# Altium schematic sheet Power Distribution.SchDoc
size A
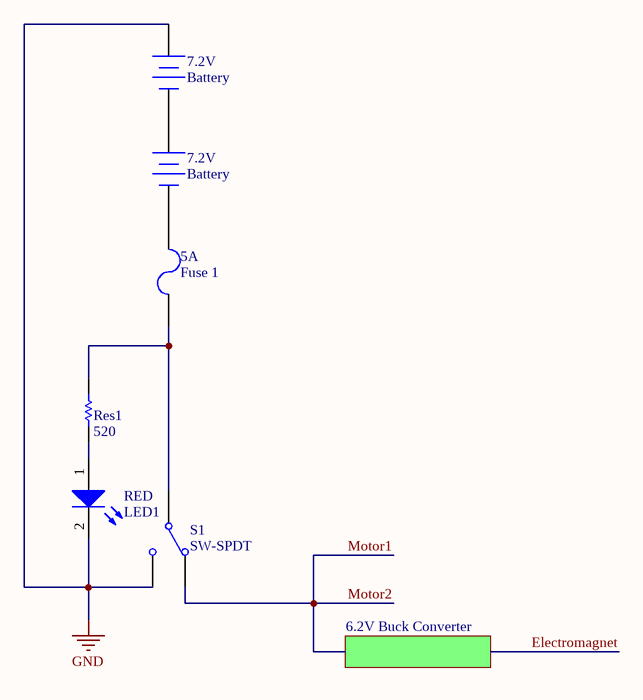
[diagram p0: Power Distribution.SchDoc]

## Parts
(Parts that share a designator on the sheet are numbered #1, #2 ... from top to bottom, then left to right.)
5A  Fuse 1  [PIN-W2/E2.8]
7.2V#1  Battery  [BAT-2]
7.2V#2  Battery  [BAT-2]
R?  Res1  value 520  [AXIAL-0.3]
RED  LED1  [LED-1]
S1  SW-SPDT  [SPDT-3]

## Sub-sheets
Designator = 6.2V Buck Converter: no entries

## Nets
GND: 7.2V#1.1(+) RED.2(K) S1.3(NO)
Motor1: S1.2(NC)  [also labelled Motor2]
Net5A_1: 5A.1 R?.2 S1.1(COMMON)
Net5A_2: 5A.2 7.2V#2.2(-)
Net7.2V#1_2: 7.2V#1.2(-) 7.2V#2.1(+)
NetR?_1: R?.1 RED.1(A)

## Library data of the parts
5A = Fuse 2: Fuse; Manufacturer: Generic Components; Class: Passive; Published: 08/06/2000; Publisher: Altium Hobart Technology Centre; SubClass: Fuse
7.2V#1 7.2V#2 = Battery: Multicell Battery; Manufacturer: Generic Components; Published: 1999
R? = Res1: Resistor; Manufacturer: Generic Components; Class: Passive; Published: 08/06/2000; Publisher: Altium Hobart Technology Centre; SubClass: Resistor
RED = LED1: Typical RED GaAs LED; Manufacturer: Generic Components; Class: Optoelectronic; Published: 08/06/2000; Publisher: Altium Hobart Technology Centre; SubClass: LED
S1 = SW-SPDT: Single-Pole, Double-Throw Switch; Manufacturer: Generic Components; Published: 1999